# Altium schematic sheet Power_Clock_proto.SchDoc
size A; Author: E. Sims; Organization: Let's Build Rockets Inc.; SheetNumber: 1; SheetTotal: 4
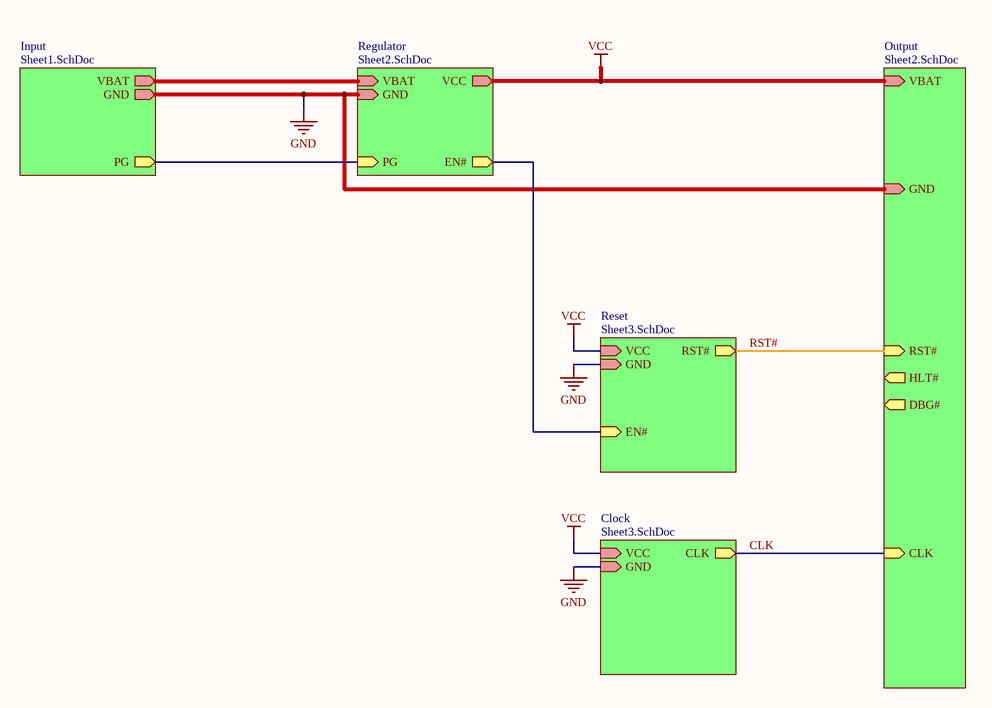
[diagram p0: Power_Clock_proto.SchDoc]

## Sub-sheets
Clock = Sheet3.SchDoc: VCC (in), GND (in), CLK (out)
Input = Sheet1.SchDoc: VBAT (out), GND (out), PG (out)
Output = Sheet2.SchDoc: VBAT (in), GND (in), RST# (in), CLK (in), HLT# (out), DBG# (out)
Regulator = Sheet2.SchDoc: PG (in), VBAT (in), GND (in), VCC (out), EN# (out)
Reset = Sheet3.SchDoc: EN# (in), VCC (in), GND (in), RST# (out)

## Nets
GND: sheet Regulator/GND, sheet Input/GND, sheet Reset/GND, sheet Clock/GND, sheet Output/GND
VCC: sheet Regulator/VCC, sheet Reset/VCC, sheet Clock/VCC, sheet Output/VBAT
CLK: sheet Clock/CLK, sheet Output/CLK
RST#: sheet Reset/RST#, sheet Output/RST#
(unnamed): sheet Regulator/PG, sheet Input/PG
(unnamed): sheet Regulator/VBAT, sheet Input/VBAT
(unnamed): sheet Regulator/EN#, sheet Reset/EN#

## Notes on the sheet
- Let's Build Rocket's Inc. Modular Paylaod System Based on TMP-010 Rev
  For more information visit https://github.com/LetsBuildRockets/Modular-Payload-System
  This work is licensed under CC BY-NC 4.0. To view a copy of this license, visit https://creativecommons.org/licenses/by-nc/4.0
- Title
- Size:
- Date:
- Assembly Variant:
- B
- Number:
- Time:
- Revision:
- Sheet
- of
- Author:
- File: